# EAGLE design attiny_midi_cv (EAGLE 7.1.0)
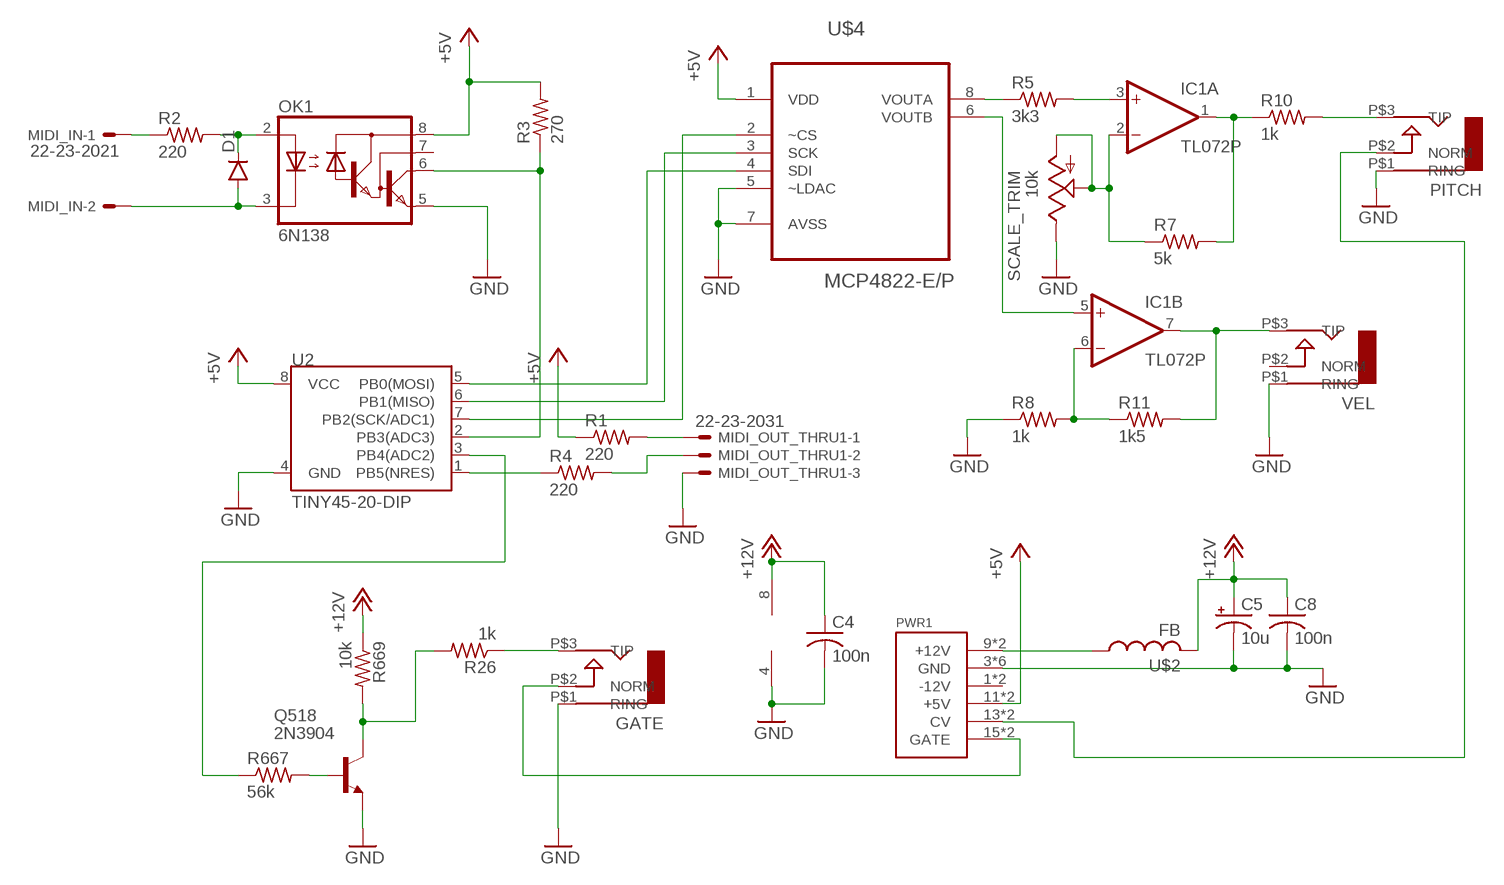
[diagram p0: schematic, sheet 1]

## Parts
C4  100n  C-US050-024X044  [C050-024X044]
C5  10u  CPOL-USB45181A  [B45181A]
C8  100n  C-US050-024X044  [C050-024X044]
D1  DIODE1N4148  [DIODE-1N4148]
GATE  AUDIO-JACK  [ERTHENVAR-JACK-90DEG]
IC1  TL072P  [DIL08]
MIDI_IN  22-23-2021  [22-23-2021]
MIDI_OUT_THRU1  22-23-2031  [22-23-2031]
OK1  6N138  [DIL08]
PITCH  AUDIO-JACK  [ERTHENVAR-JACK-90DEG]
PWR1  POWER  [POWER_16]
Q518  2N3904  [TO92]
R1  220  R-US_0207/7  [0207/7]
R2  220  R-US_0207/7  [0207/7]
R3  270  R-US_0207/7  [0207/7]
R4  220  R-US_0207/7  [0207/7]
R5  3k3  R-US_0207/7  [0207/7]
R7  5k  R-US_0207/7  [0207/7]
R8  1k  R-US_0207/7  [0207/7]
R10  1k  R-US_0207/7  [0207/7]
R11  1k5  R-US_0207/7  [0207/7]
R26  1k  R-US_0309/10  [0309/10]
R667  56k  R-US_0207/7  [0207/7]
R669  10k  R-US_0207/7  [0207/7]
SCALE_TRIM  10k  TRIM_US-B64W  [B64W]
U2  TINY45-20-DIP  ATTINY45TINY45-20-DIP  [DIP08]
U$2  FB  [FB]
U$4  MCP4822-E/P  [DIP254P762X432-8]
VEL  AUDIO-JACK  [ERTHENVAR-JACK-90DEG]

## Nets
+5V: OK1.8(VCC) PWR1.11(+5V) PWR1.12(+5V) R1.1 R3.2 U2.8(VCC) U$4.1(VDD)
+12V: C4.1 C5.+ C8.1 IC1.8(P:V+) R669.1 U$2.P$2
GND: C4.2 C5.- C8.2 GATE.P$1(RING) IC1.4(P:V-) MIDI_OUT_THRU1.3 OK1.5(GND) PITCH.P$1(RING) PWR1.3(GND) PWR1.4(GND) PWR1.5(GND) PWR1.6(GND) PWR1.7(GND) PWR1.8(GND) Q518.3(E) R8.1 SCALE_TRIM.E U2.4(GND) U$4.5(~LDAC) U$4.7(AVSS) VEL.P$1(RING)
N$2: R5.1 U$4.8(VOUTA)
N$3: D1.A MIDI_IN.2 OK1.3(C)
N$4: GATE.P$3(TIP) R26.1
N$5: PITCH.P$3(TIP) R10.2
N$6: IC1.3(A:+IN) R5.2
N$7: D1.C OK1.2(A) R2.2
N$8: MIDI_IN.1 R2.1
N$9: MIDI_OUT_THRU1.1 R1.2
N$10: MIDI_OUT_THRU1.2 R4.2
N$11: PWR1.9(+12V) PWR1.10(+12V) U$2.P$1
N$12: IC1.2(A:-IN) R7.1 SCALE_TRIM.A SCALE_TRIM.S
N$13: IC1.6(B:-IN) R8.2 R11.1
N$14: IC1.5(B:+IN) U$4.6(VOUTB)
N$15: PITCH.P$2(NORM) PWR1.13(CV) PWR1.14(CV)
N$16: R4.1 U2.1(PB5(NRES))
N$17: IC1.7(B:OUT) R11.2 VEL.P$3(TIP)
N$20: Q518.1(C) R26.2 R669.2
N$21: Q518.2(B) R667.2
N$24: R667.1 U2.3(PB4(ADC2))
N$25: U2.6(PB1(MISO)) U$4.3(SCK)
N$26: U2.5(PB0(MOSI)) U$4.4(SDI)
N$27: IC1.1(A:OUT) R7.2 R10.1
N$30: OK1.6(VO) R3.1 U2.2(PB3(ADC3))
N$31: GATE.P$2(NORM) PWR1.15(GATE) PWR1.16(GATE)
N$45: U2.7(PB2(SCK/ADC1)) U$4.2(~CS)
Unconnected: OK1.7(VB) PWR1.1(-12V) PWR1.2(-12V) VEL.P$2(NORM)

## Library data of the parts
C4 C8 = rcl:C-US: CAPACITOR, American symbol
C5 = rcl:CPOL-US: POLARIZED CAPACITOR, American symbol
D1 = SparkFun-DiscreteSemi:DIODE: Diode These are standard reverse protection diodes and small signal diodes. SMA package can handle up to about 1A. SOD-323 can handle about 200mA. What the SOD-323 package when ordering, there are some mfgs out there that are 5-pin packages.
GATE PITCH VEL = erthenvar:AUDIO-JACK: Switching Mono 3.5mm Audio Jack from Erthenvar.
IC1 = linear:TL072: OP AMP
MIDI_IN = con-molex:22-23-2021: .100" (2.54mm) Center Header - 2 Pin; MF: MOLEX; MPN: 22-23-2021; OC_FARNELL: 1462926; OC_NEWARK: 25C3832
MIDI_OUT_THRU1 = con-molex:22-23-2031: .100" (2.54mm) Center Header - 3 Pin; MF: MOLEX; MPN: 22-23-2031; OC_FARNELL: 1462950; OC_NEWARK: 30C0862
OK1 = optocoupler:6N138: MOTOROLA OPTO COUPLER; MF: VISHAY/TELEFUNKEN; MPN: 6N138; OC_FARNELL: 9860150; OC_NEWARK: 35K5294
PWR1 = eurorack:POWER
Q518 = 808_lt:2N3904: NPN Transistor
R1-R5 R7 R8 R10 R11 R26 R667 R669 = rcl:R-US_: RESISTOR, American symbol
SCALE_TRIM = pot:TRIM_US-: POTENTIOMETER
U2 = SparkFun-DigitalIC:ATTINY45: Atmel 8-pin 2/4/8kB flash uC; PROD_ID: IC-09439
U$2 = adafruit:FB: Ferrite bead Digikey #P9821BK-ND
U$4 = MCP4822:MCP4822-E/P: DAC; MPN: MCP4822-E/P; OC_FARNELL: 1439413; OC_NEWARK: 11M1705; PACKAGE: DIP-8; SUPPLIER: Microchip

## Net classes
0 default: width 0.635 mm, drill 0.254 mm, clearance 0.254 mm
1 GND: width 1.016 mm, drill 1.016 mm, clearance 0.508 mm

## Board
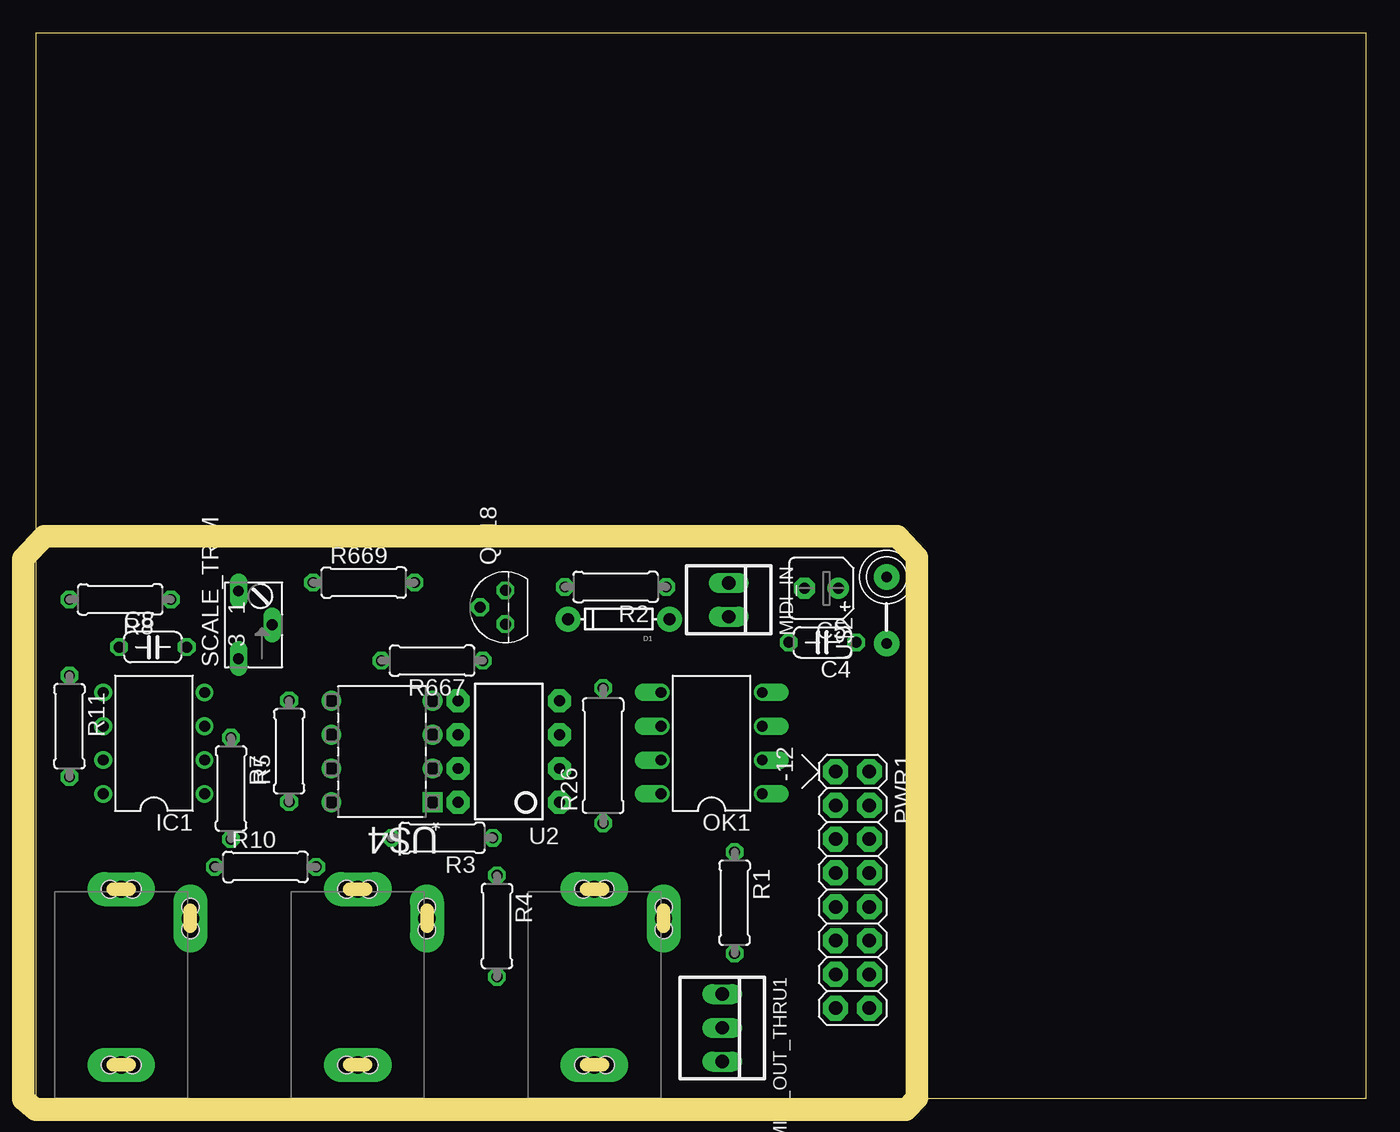
[diagram p1: board, top side]
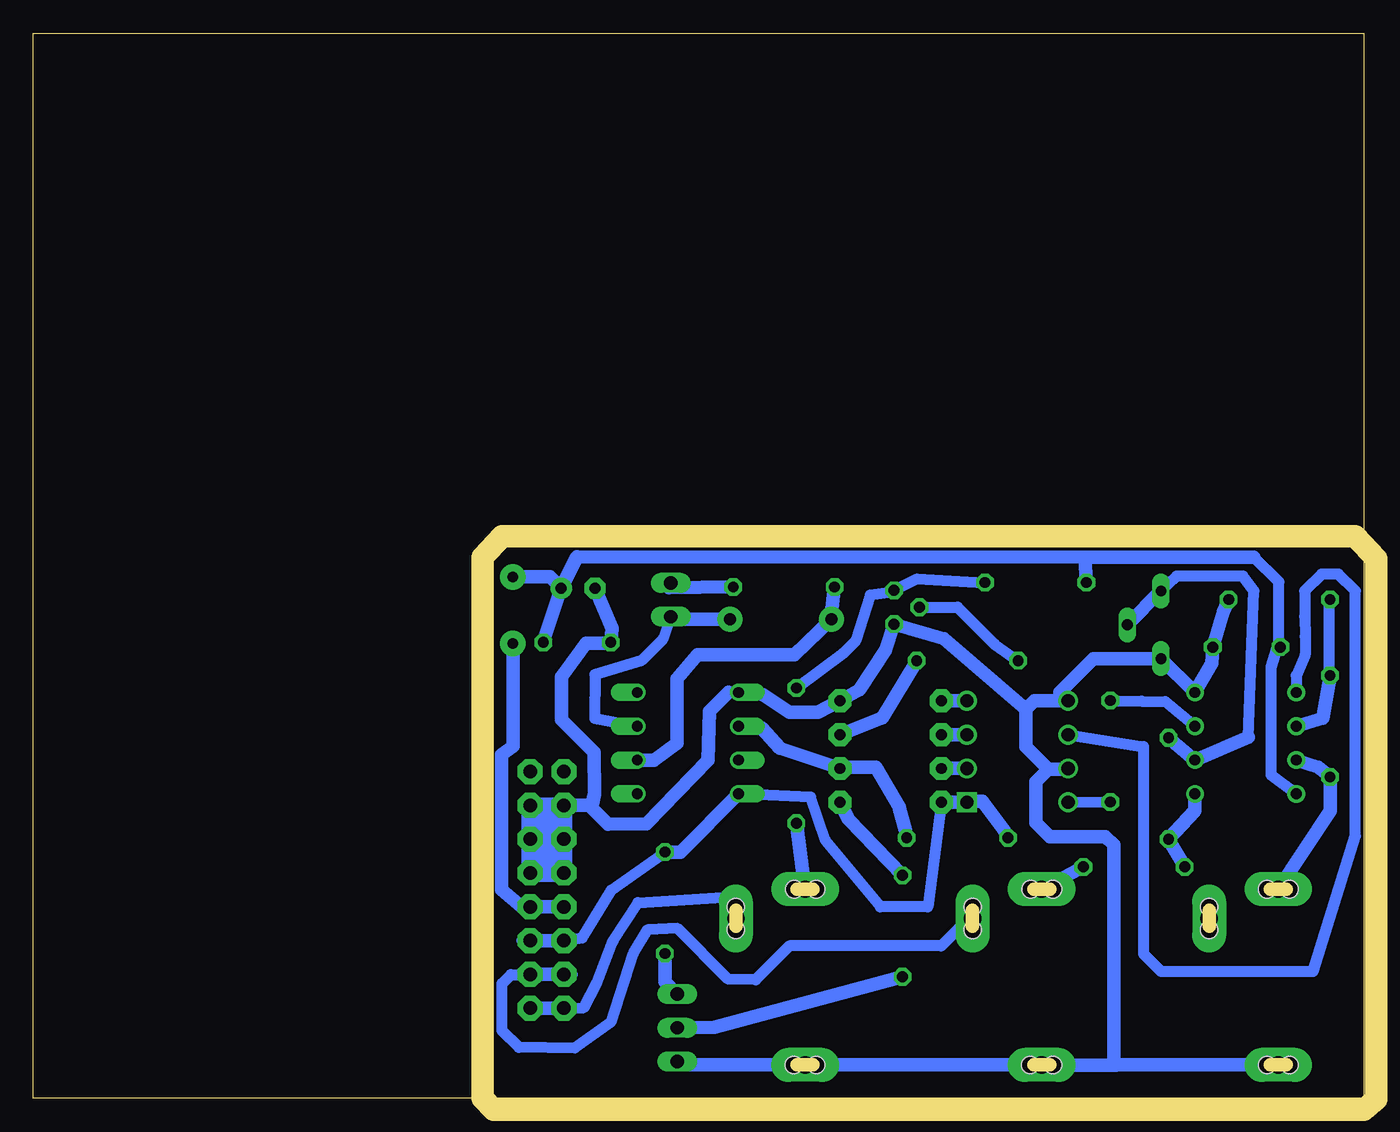
[diagram p2: board, bottom side, seen from below]

Size 100 x 80 mm. Coordinates in mm from the lower left corner, seen from the top.
Outline: 0,0 100,0 100,80 0,80 0,0
Copper layers (1*16): Top 0.035mm / dielectric 1.5mm / Bottom 0.035mm
Design rules "default *": minimum track width 32mil, minimum drill 31mil, track to track 18mil, track to pad 18mil, pad to pad 18mil, via to via 18mil, smd to smd 8mil, copper to edge 0mil, drill to drill 18mil, minimum pad ring 10mil, minimum via ring 8mil, stop-mask expansion 4mil, vias tented up to drill 0mil, thermal gap 10mil
Milling: 8 lines

### Footprints (pad centres in the part's own frame; a part is rotated, then mirrored left to right if it is on the bottom)
C050-024X044 = drill 0.813 octagon: 1 -2.54,0; 2 2.54,0
B45181A = drill 0.813 pad 1.6: + -1.27,0 | drill 0.813 pad 1.6 octagon: - 1.27,0
DIODE-1N4148 = drill 0.9 pad 1.88: A -3.81,0; C 3.81,0
ERTHENVAR-JACK-90DEG = drill 1.3 pad 2.54 long: P$1 5,-2.5; P$2 -0.2,-13.5; P$3 5,-15.7 | hole 1.3: 5.842,-2.489; 4.14,-2.489; -0.203,-12.649; -0.203,-14.351; 5.842,-15.697; 4.166,-15.697
DIL08 = drill 0.813 pad 1.27: 1 -3.81,-3.81; 2 -1.27,-3.81; 3 1.27,-3.81; 4 3.81,-3.81; 5 3.81,3.81; 6 1.27,3.81; 7 -1.27,3.81; 8 -3.81,3.81
22-23-2021 = drill 1 long: 1 -1.27,0; 2 1.27,0
22-23-2031 = drill 1 long: 1 -2.54,0; 2 0,0; 3 2.54,0
DIL08' = drill 0.813 offset: 1 -3.81,-3.81; 2 -1.27,-3.81; 3 1.27,-3.81; 4 3.81,-3.81; 5 3.81,3.81; 6 1.27,3.81; 7 -1.27,3.81; 8 -3.81,3.81
POWER_16 = drill 1.016 pad 1.88 octagon: 1 -6.35,-1.27; 2 -6.35,1.27; 3 -3.81,-1.27; 4 -3.81,1.27; 5 -1.27,-1.27; 6 -1.27,1.27; 7 1.27,-1.27; 8 1.27,1.27; 9 3.81,-1.27; 10 3.81,1.27; 11 6.35,-1.27; 12 6.35,1.27; 13 8.89,-1.27; 14 8.89,1.27; 15 11.43,-1.27; 16 11.43,1.27
TO92 = drill 0.813 octagon: 1 1.27,0; 2 0,1.905; 3 -1.27,0
0207/7 = drill 0.813 octagon: 1 -3.81,0; 2 3.81,0
0309/10 = drill 0.813 octagon: 1 -5.08,0; 2 5.08,0
B64W = drill 0.813 long: A 2.54,0; E -2.54,0; S 0,-2.54
DIP08 = drill 0.813 pad 1.727 octagon: 1 -3.81,-3.81; 2 -1.27,-3.81; 3 1.27,-3.81; 4 3.81,-3.81; 5 3.81,3.81; 6 1.27,3.81; 7 -1.27,3.81; 8 -3.81,3.81
FB = drill 0.8 pad 1.93: P$1 -2.5,0; P$2 2.5,0
DIP254P762X432-8 = drill 0.991 square: 1 -7.62,7.62 | drill 0.991: 2 -7.62,5.08; 3 -7.62,2.54; 4 -7.62,0; 5 0,0; 6 0,2.54; 7 0,5.08; 8 0,7.62

### Placement (x,y rotation side)
C4  59.13,34.24 180 top
C5  59.05,38.3 180 top
C8  8.81,33.88 0 top
D1  43.81,35.99 180 top
GATE  46.99,0 180 top
IC1  8.89,26.67 90 top
MIDI_IN  52.1,37.44 270 top
MIDI_OUT_THRU1  51.61,5.28 270 top
OK1  6N138  [DIL08']  50.8,26.67 90 top
PITCH  29.21,0 180 top
PWR1  61.39,18.19 270 top
Q518  35.31,36.88 90 top
R1  52.53,14.68 270 top
R2  43.59,38.4 180 top
R3  30.56,19.56 180 top
R4  34.67,12.93 270 top
R5  19.05,26.06 90 top
R7  14.68,23.27 270 top
R8  6.35,37.47 180 top
R10  17.27,17.37 0 top
R11  2.54,27.94 270 top
R26  42.65,25.73 90 top
R667  29.79,32.87 180 top
R669  24.66,38.73 0 top
SCALE_TRIM  15.24,35.56 90 top
U2  35.56,26.04 90 top
U$2  63.96,36.65 90 top
U$4  22.23,29.84 180 top
VEL  11.43,0 180 top

### Tracks (layer width: path | path; a pad name or v marks a point on that pad's centre or on a via)
+5V
  Bottom 0.813: PWR1.11 58.75,12.04 56.57,15.62 R1.1 | PWR1.12 63.3,11.84 | U2.8 32.77,14.38 36.35,14.38 40.46,19.36 41.58,22.63 46.35,22.86 OK1.8 | 29.74,22.12 U$4.1 29.77,22.3 | R3.2 27.03,20.09
  Bottom 1.016: U2.8 U$4.1 | PWR1.12 PWR1.11 | 27.03,20.09 28.65,22.3 29.77,22.3 | R1.1 51.36,18.49 OK1.8
+12V
  Bottom 0.813: IC1.8 6.99,24.28 6.99,32.38 6.38,34.34 | C8.1 6.38,34.34 | 8.26,40.64 6.38,38.79 6.38,34.34
  Bottom 1.016: C4.1 C5.+ | 20.95,40.64 R669.1 | 8.26,40.64 20.95,40.64 | C5.+ 59.13,40.69 20.95,40.64 | U$2.P$2 61.17,39.15 C5.+
GND
  Bottom 0.813: 45.16,30.3 46.81,30.3 OK1.5 47.75,30.48 | 60.07,16.97 PWR1.7 | 51.37,2.5 MIDI_OUT_THRU1.3
  Bottom 1.016: 58.22,22 PWR1.3 PWR1.4 PWR1.6 | 58.22,22 58.01,22 57.84,22.86 57.86,25.98 60.3,28.42 60.3,31.67 58.47,34.19 57.07,34.19 C4.2 56.52,35.31 C5.- | 25.4,29.21 31.57,34.52 Q518.3 35.97,33.66 37.92,30.68 U2.4 41.02,28.98 43.18,28.98 45.16,30.3 | 25.4,29.21 24.77,29.84 U$4.5 22.86,30.48 20.32,33.02 SCALE_TRIM.E IC1.4 11.43,32.69 C8.2 10.57,36.55 R8.1 | 25.4,29.21 25.4,26.42 23.7,24.71 | 23.7,24.71 22.28,24.71 U$4.7 | 18.8,2.46 18.64,2.46 18.61,2.5 VEL.P$1 | 18.8,2.46 25.44,2.46 PITCH.P$1 GATE.P$1 51.37,2.5 | PWR1.6 PWR1.5 PWR1.7 | PWR1.8 PWR1.6 | 47.75,30.48 49.17,29.06 49.28,25.4 53.9,20.62 56.79,20.57 58.22,22 | 18.8,2.46 18.8,19.02 19.43,19.63 23.6,19.63 24.64,20.68 24.64,23.77 23.7,24.71
N$2
  Bottom 0.813: U$4.8 R5.1
N$3
  Bottom 0.813: 52.4,35.99 MIDI_IN.2 52.68,34.49 54.3,32.87 57.78,31.83 57.81,28.52 OK1.3
  Bottom 1.016: D1.A 52.4,35.99
N$4
  Bottom 1.016: R26.1 GATE.P$3
N$5
  Bottom 1.016: R10.2 PITCH.P$3
N$6
  Bottom 0.813: IC1.3 14.94,29.79 16.71,29.82 R5.2
N$7
  Bottom 0.813: 40.06,36.14 D1.C
  Bottom 1.016: R2.2 40.06,36.14 | OK1.2 53.34,25.4 51.64,26.64 51.64,31.5 50.09,33.33 42.8,33.33 D1.C
N$8
  Bottom 1.016: R2.1 52.22,38.35 MIDI_IN.1
N$9
  Bottom 1.016: R1.2 52.53,8.74 MIDI_OUT_THRU1.1
N$10
  Bottom 1.016: R4.2 48.79,5.31 MIDI_OUT_THRU1.2
N$11
  Bottom 0.813: PWR1.10 63.3,14.38
  Bottom 1.016: PWR1.10 PWR1.9 | U$2.P$1 63.93,26.44 64.8,25.81 64.8,15.65 63.3,14.38
N$12
  Bottom 0.813: 8.69,27.1 8.26,38.1 9.09,39.22 14.07,39.22 14.5,38.84 SCALE_TRIM.A
  Bottom 1.016: R7.1 IC1.2 8.69,27.1 | SCALE_TRIM.A SCALE_TRIM.S
N$13
  Bottom 0.813: R8.2 2.62,36.88 2.62,32.44 R11.1
  Bottom 1.016: R11.1 3.07,28.55 IC1.6
N$14
  Bottom 0.813: IC1.5 5.08,31.75 4.42,33.3 4.42,34.67 4.45,36.2 4.45,38.1 3.17,39.37 1.91,39.37 0.64,38.1 0.64,19.68 3.81,9.53 15.24,9.53 16.56,10.85 16.56,26.42 U$4.6
N$15
  Bottom 0.813: PWR1.13 59.49,9.3 | PITCH.P$2 29.68,13.5 31.75,11.43 43.18,11.43 45.72,8.89 47.78,8.94 51.59,12.75 53.85,12.65 54.91,10.85 56.59,5.71 59.31,3.76 63.5,3.81 64.77,5.08 64.77,8.61 64.11,9.27 62.69,9.27 PWR1.14
  Bottom 1.016: PWR1.13 PWR1.14
N$16
  Bottom 1.016: U2.1 38.73,20.95 R4.1
N$17
  Bottom 1.016: IC1.7 3.43,24.87 R11.2 2.54,21.59 VEL.P$3
N$20
  Bottom 0.813: R669.2 33.58,39.01 Q518.1 35.15,38.05 37.08,37.8 38.18,34.37 39.12,33.43 R26.2
N$21
  Bottom 0.813: Q518.2 30.53,36.88 27.76,34.11 R667.2
N$24
  Bottom 1.016: R667.1 36.2,28.57 U2.3
N$25
  Bottom 1.016: U2.6 U$4.3
N$26
  Bottom 1.016: U2.5 U$4.4
N$27
  Bottom 1.016: R10.1 R7.2 12.7,21.59 IC1.1
N$30
  Bottom 0.813: 45.26,27.81 46.86,27.81 OK1.6 | R3.1 34.44,20.14 | 39.27,24.87 U2.2
  Bottom 1.016: U2.2 43.89,26.29 45.26,27.81 | 34.44,20.14 34.9,21.74 34.9,21.84 36.65,24.87 39.27,24.87
N$31
  Bottom 0.813: PWR1.15 58.62,6.81 57.63,8.66 56.41,11.81 54.56,14.68 48.12,15.09 GATE.P$2
  Bottom 1.016: PWR1.16 PWR1.15
N$45
  Bottom 1.016: U2.7 U$4.2
(copper drawn outside any net)
  shapes: Bottom area x1